# EAGLE schematic hat (EAGLE 7.4.0)
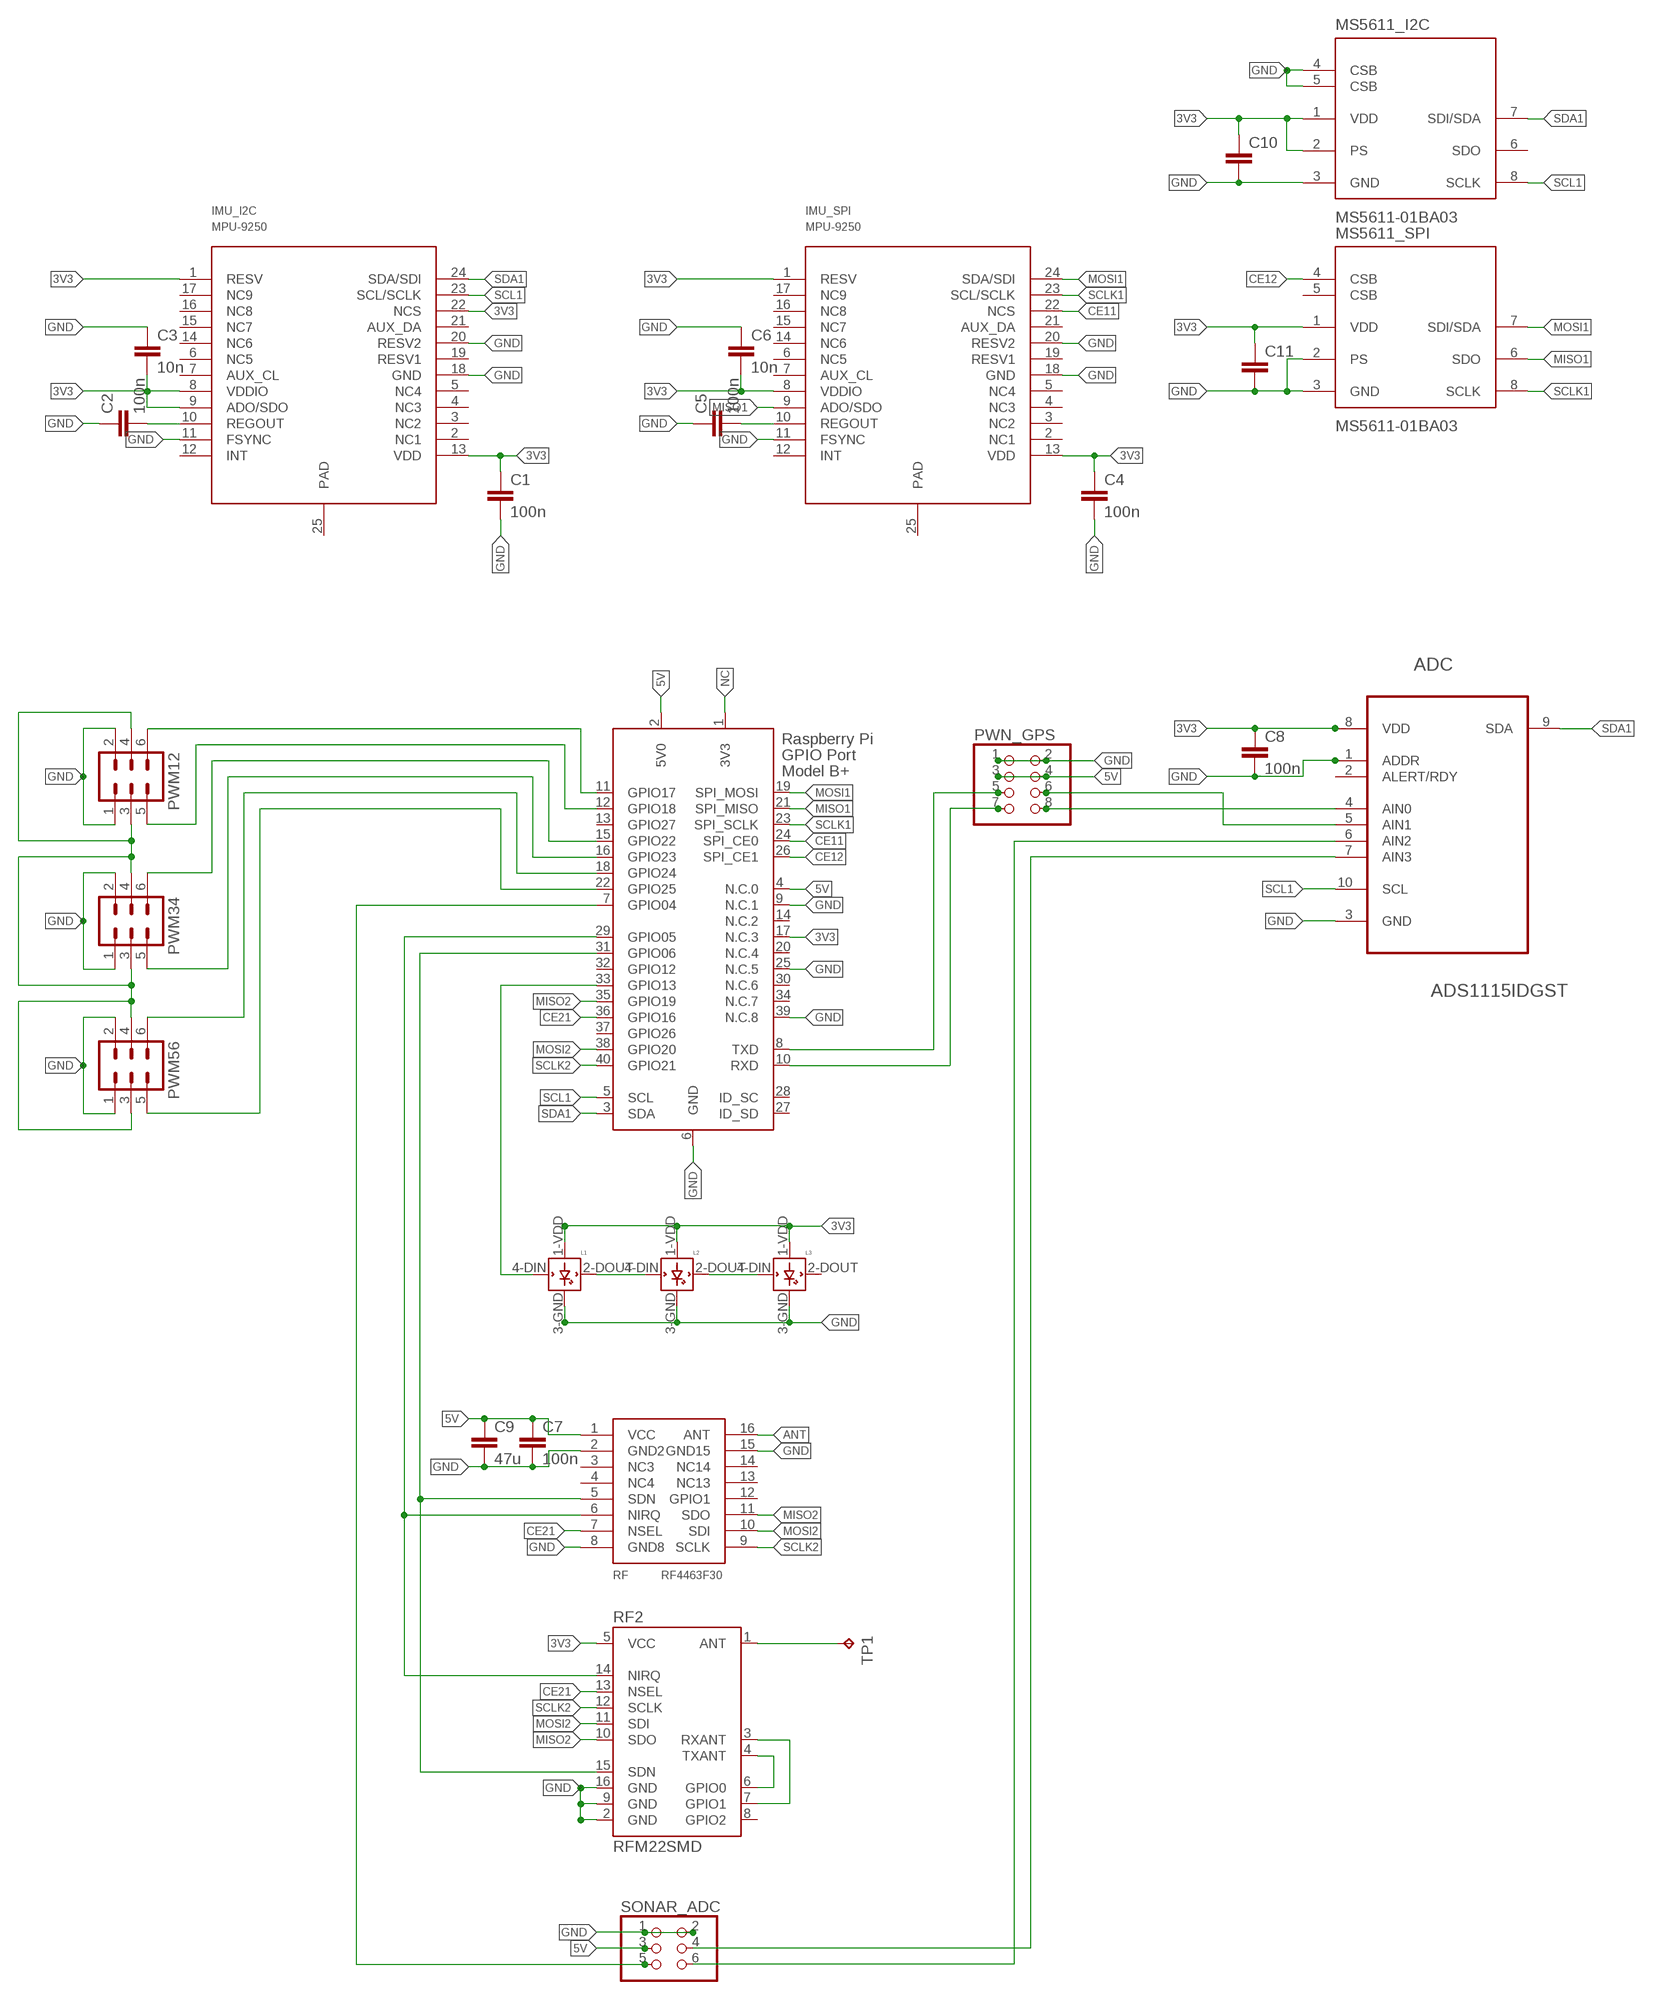
[diagram p0: schematic, sheet 1]

## Parts
ADC  ADS1115IDGST  [SOP50P490X110-10N]
C1  100n  C-EUC0603  [C0603]
C2  100n  C-EUC0603  [C0603]
C3  10n  C-EUC0603  [C0603]
C4  100n  C-EUC0603  [C0603]
C5  100n  C-EUC0603  [C0603]
C6  10n  C-EUC0603  [C0603]
C7  100n  C-EUC0603  [C0603]
C8  100n  C-EUC0603  [C0603]
C9  47u  C-EUC0603  [C0603]
C10  C-EUC0603  [C0603]
C11  C-EUC0603  [C0603]
IMU_I2C  MPU-9250  [LEAD-QFN24]
IMU_SPI  MPU-9250  [LEAD-QFN24]
L1  WS2812B  [WS2812B]
L2  WS2812B  [WS2812B]
L3  WS2812B  [WS2812B]
MS5611_I2C  MS5611-01BA03  [SON125P300X500X100-8N]
MS5611_SPI  MS5611-01BA03  [SON125P300X500X100-8N]
PWM12  MA03-2  [MA03-2]
PWM34  MA03-2  [MA03-2]
PWM56  MA03-2  [MA03-2]
PWN_GPS  PINHD-2X4/90  [2X04/90]
RF  RF4463F30  [RF4463F30]
RF2  RFM22SMD  [RFM22-XXX-S2]
SONAR_ADC  PINHD-2X3/90  [2X03/90]
TP1  TPTP20SQ  [TP20SQ]
X1  RASPI_BOARD_B+_H  [RASPI_BOARD_B+HAT]

## Nets
3V3: ADC.8(VDD) C1.1 C3.2 C4.1 C6.2 C8.1 C10.1 C11.1 IMU_I2C.1(RESV) IMU_I2C.8(VDDIO) IMU_I2C.9(ADO/SDO) IMU_I2C.13(VDD) IMU_I2C.22(NCS) IMU_SPI.1(RESV) IMU_SPI.8(VDDIO) IMU_SPI.13(VDD) L1.1-VDD(VDD) L2.1-VDD(VDD) L3.1-VDD(VDD) MS5611_I2C.1(VDD) MS5611_I2C.2(PS) MS5611_SPI.1(VDD) RF2.5(VCC) X1.17(N.C.3)
5V: C7.1 C9.1 PWN_GPS.3 PWN_GPS.4 RF.1(VCC) SONAR_ADC.3 X1.2(5V0) X1.4(N.C.0)
ANT: RF.16(ANT)
CE11: IMU_SPI.22(NCS) X1.24(SPI_CE0)
CE12: MS5611_SPI.4(CSB) X1.26(SPI_CE1)
CE21: RF2.13(NSEL) RF.7(NSEL) X1.36(GPIO16)
GND: ADC.1(ADDR) ADC.3(GND) C1.2 C2.1 C3.1 C4.2 C5.1 C6.1 C7.2 C8.2 C9.2 C10.2 C11.2 IMU_I2C.11(FSYNC) IMU_I2C.18(GND) IMU_I2C.20(RESV2) IMU_SPI.11(FSYNC) IMU_SPI.18(GND) IMU_SPI.20(RESV2) L1.3-GND(GND) L2.3-GND(GND) L3.3-GND(GND) MS5611_I2C.3(GND) MS5611_I2C.4(CSB) MS5611_I2C.5(CSB) MS5611_SPI.2(PS) MS5611_SPI.3(GND) PWM12.1 PWM12.2 PWM34.1 PWM34.2 PWM56.1 PWM56.2 PWN_GPS.1 PWN_GPS.2 RF2.2(GND) RF2.9(GND) RF2.16(GND) RF.2(GND2) RF.8(GND8) RF.15(GND15) SONAR_ADC.1 SONAR_ADC.2 X1.6(GND) X1.9(N.C.1) X1.25(N.C.5) X1.39(N.C.8)
MISO1: IMU_SPI.9(ADO/SDO) MS5611_SPI.6(SDO) X1.21(SPI_MISO)
MISO2: RF2.10(SDO) RF.11(SDO) X1.35(GPIO19)
MOSI1: IMU_SPI.24(SDA/SDI) MS5611_SPI.7(SDI/SDA) X1.19(SPI_MOSI)
MOSI2: RF2.11(SDI) RF.10(SDI) X1.38(GPIO20)
N$1: C2.2 IMU_I2C.10(REGOUT)
N$2: C5.2 IMU_SPI.10(REGOUT)
N$3: L1.2-DOUT(DOUT) L2.4-DIN(DIN)
N$4: L2.2-DOUT(DOUT) L3.4-DIN(DIN)
N$5: SONAR_ADC.5 X1.7(GPIO04)
N$6: ADC.6(AIN2) SONAR_ADC.6
N$7: ADC.7(AIN3) SONAR_ADC.4
N$8: PWM12.6 X1.11(GPIO17)
N$9: PWM12.5 X1.12(GPIO18)
N$10: L1.4-DIN(DIN) X1.33(GPIO13)
N$11: RF2.15(SDN) RF.5(SDN) X1.31(GPIO06)
N$12: ADC.5(AIN1) PWN_GPS.6
N$13: PWM34.6 X1.15(GPIO22)
N$14: PWM34.5 X1.16(GPIO23)
N$15: PWM56.6 X1.18(GPIO24)
N$16: PWM56.5 X1.22(GPIO25)
N$17: RF2.14(NIRQ) RF.6(NIRQ) X1.29(GPIO05)
N$18: RF2.1(ANT) TP1.TP
N$19: RF2.4(TXANT) RF2.6(GPIO0)
N$20: RF2.3(RXANT) RF2.7(GPIO1)
N$21: ADC.4(AIN0) PWN_GPS.8
N$23: PWN_GPS.5 X1.8(TXD)
N$24: PWN_GPS.7 X1.10(RXD)
N$28: PWM12.3 PWM12.4 PWM34.3 PWM34.4 PWM56.3 PWM56.4
NC: X1.1(3V3)
SCL1: ADC.10(SCL) IMU_I2C.23(SCL/SCLK) MS5611_I2C.8(SCLK) X1.5(SCL)
SCLK1: IMU_SPI.23(SCL/SCLK) MS5611_SPI.8(SCLK) X1.23(SPI_SCLK)
SCLK2: RF2.12(SCLK) RF.9(SCLK) X1.40(GPIO21)
SDA1: ADC.9(SDA) IMU_I2C.24(SDA/SDI) MS5611_I2C.7(SDI/SDA) X1.3(SDA)
Unconnected: ADC.2(ALERT/RDY) IMU_I2C.2(NC1) IMU_I2C.3(NC2) IMU_I2C.4(NC3) IMU_I2C.5(NC4) IMU_I2C.6(NC5) IMU_I2C.7(AUX_CL) IMU_I2C.12(INT) IMU_I2C.14(NC6) IMU_I2C.15(NC7) IMU_I2C.16(NC8) IMU_I2C.17(NC9) IMU_I2C.19(RESV1) IMU_I2C.21(AUX_DA) IMU_I2C.25(PAD) IMU_SPI.2(NC1) IMU_SPI.3(NC2) IMU_SPI.4(NC3) IMU_SPI.5(NC4) IMU_SPI.6(NC5) IMU_SPI.7(AUX_CL) IMU_SPI.12(INT) IMU_SPI.14(NC6) IMU_SPI.15(NC7) IMU_SPI.16(NC8) IMU_SPI.17(NC9) IMU_SPI.19(RESV1) IMU_SPI.21(AUX_DA) IMU_SPI.25(PAD) L3.2-DOUT(DOUT) MS5611_I2C.6(SDO) MS5611_SPI.5(CSB) RF2.8(GPIO2) RF.3(NC3) RF.4(NC4) RF.12(GPIO1) RF.13(NC13) RF.14(NC14) X1.13(GPIO27) X1.14(N.C.2) X1.20(N.C.4) X1.27(ID_SD) X1.28(ID_SC) X1.30(N.C.6) X1.32(GPIO12) X1.34(N.C.7) X1.37(GPIO26)

## Library data of the parts
ADC = Texas Instruments_By_element14_Batch_1:ADS1115IDGST: Analog-to-Digital Converter with Internal Reference; MPN: ADS1115IDGST; OC_FARNELL: 1762981; OC_NEWARK: 25R1241; PACKAGE: MSOP-10; SUPPLIER: Texas Instruments
C1-C11 = resistor:C-EU: CAPACITOR, European symbol
IMU_I2C IMU_SPI = invensense:MPU-9250
L1-L3 = adafruit:WS2812B
MS5611_I2C MS5611_SPI = Measurement-Specialties:MS5611-01BA03: Variometer Module, with stainless steel cap
PWM12 PWM34 PWM56 = con-lstb:MA03-2: PIN HEADER; OC_FARNELL: unknown; OC_NEWARK: unknown
PWN_GPS = pinhead+:PINHD-2X4: PIN HEADER
RF = nicerf:RF4463F30
RF2 = SparkFun:RFM22: Description: The RFM22 is a low-power, low cost radio that is capable of operating in the 434MHz and 900MHz open bands. It's frequency is software defined and there are some very good libraries written for it.
SONAR_ADC = pinhead+:PINHD-2X3: PIN HEADER
TP1 = testpad:TP: Test pad
X1 = raspberrypi_bastelstube_v13:RASPI_BOARD_B+: Raspberry Pi GPIO connector with markings for the outer dimensions of the Raspberry Pi board model B+ with different sets of drill holes or mounting pads